# Altium schematic sheet MCU.SchDoc
size A4
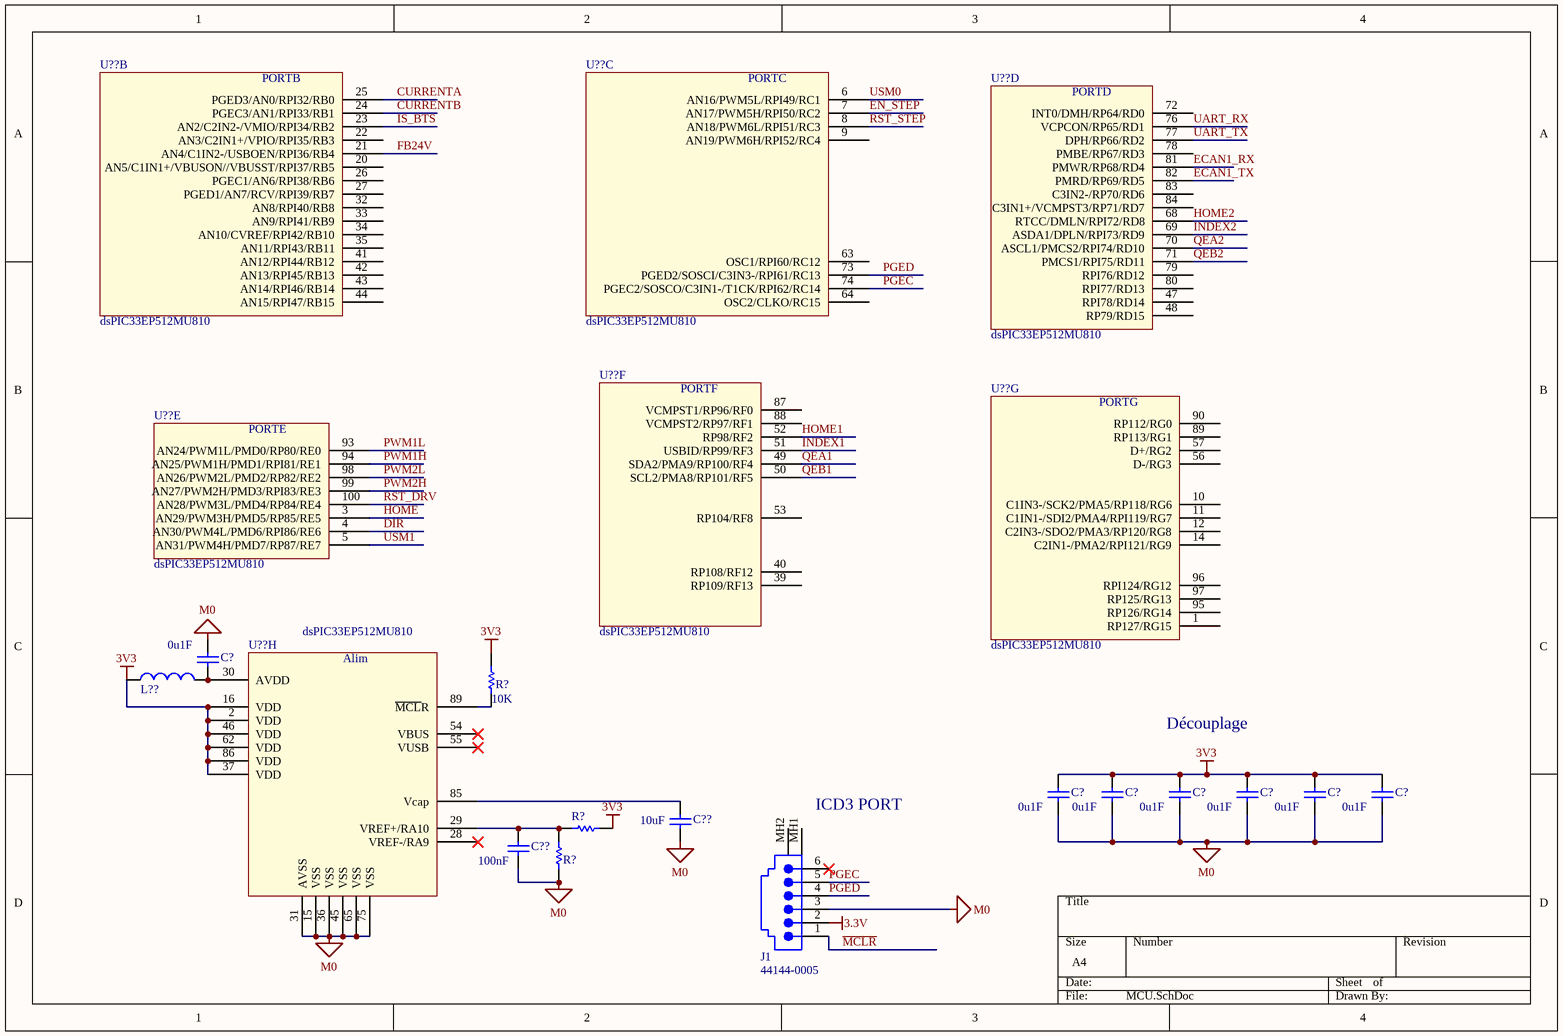
[diagram p0: MCU.SchDoc]

## Parts
(Parts that share a designator on the sheet are numbered #1, #2 ... from top to bottom, then left to right.)
C?#1  value 0u1F  [0603]  (hidden comment: C0603)
C?#2  value 0u1F  [0603]  (hidden comment: C0603)
C?#3  value 0u1F  [0603]  (hidden comment: C0603)
C?#4  value 0u1F  [0603]  (hidden comment: C0603)
C?#5  value 0u1F  [0603]  (hidden comment: C0603)
C?#6  value 0u1F  [0603]  (hidden comment: C0603)
C?#7  value 0u1F  [0603]  (hidden comment: C0603)
C??#1  10uF  [C0805]
C??#2  100nF  [C0805]
J1  44144-0005  [44144-0005]
L??  Ferrite_0805  [R0805]  (value not drawn)
R?#1  10K  [R0805]
R?#2  (no value)  [R0805]
R?#3  (no value)  [R0805]
U??#1  dsPIC33EP512MU810  (part C of 8)
U??#2  dsPIC33EP512MU810  (part B of 8)
U??#3  dsPIC33EP512MU810  (part D of 8)
U??#4  dsPIC33EP512MU810  (part E of 8)
U??#5  dsPIC33EP512MU810  (part G of 8)
U??#6  dsPIC33EP512MU810  (part F of 8)
U??#7  dsPIC33EP512MU810  (part H of 8)

## Nets
3.3V: J1.2
3V3: C?#2.2 C?#3.2 C?#4.2 C?#5.2 C?#6.2 C?#7.2 R?#1.2 R?#2.1 U??#7.2(VDD) U??#7.16(VDD) U??#7.37(VDD) U??#7.46(VDD) U??#7.62(VDD) U??#7.86(VDD)
M0: C?#1.2 C?#2.1 C?#3.1 C?#4.1 C?#5.1 C?#6.1 C?#7.1 C??#1.2 C??#2.2 J1.3 R?#3.1 U??#7.15(VSS) U??#7.31(AVSS) U??#7.36(VSS) U??#7.45(VSS) U??#7.65(VSS) U??#7.75(VSS)
CURRENTA: U??#2.25(PGED3/AN0/RPI32/RB0)
CURRENTB: U??#2.24(PGEC3/AN1/RPI33/RB1)
DIR: U??#4.4(AN30/PWM4L/PMD6/RPI86/RE6)
ECAN1_RX: U??#3.81(PMWR/RP68/RD4)
ECAN1_TX: U??#3.82(PMRD/RP69/RD5)
EN_STEP: U??#1.7(AN17/PWM5H/RPI50/RC2)
FB24V: U??#2.21(AN4/C1IN2-/USBOEN/RPI36/RB4)
HOME: U??#4.3(AN29/PWM3H/PMD5/RP85/RE5)
HOME1: U??#6.52(RP98/RF2)
HOME2: U??#3.68(RTCC/DMLN/RPI72/RD8)
INDEX1: U??#6.51(USBID/RP99/RF3)
INDEX2: U??#3.69(ASDA1/DPLN/RPI73/RD9)
IS_BTS: U??#2.23(AN2/C2IN2-/VMIO/RPI34/RB2)
~{MCLR}: J1.1
PGEC: J1.5 U??#1.74(PGEC2/SOSCO/C3IN1-/T1CK/RPI62/RC14)
PGED: J1.4 U??#1.73(PGED2/SOSCI/C3IN3-/RPI61/RC13)
PWM1H: U??#4.94(AN25/PWM1H/PMD1/RPI81/RE1)
PWM1L: U??#4.93(AN24/PWM1L/PMD0/RP80/RE0)
PWM2H: U??#4.99(AN27/PWM2H/PMD3/RPI83/RE3)
PWM2L: U??#4.98(AN26/PWM2L/PMD2/RP82/RE2)
QEA1: U??#6.49(SDA2/PMA9/RP100/RF4)
QEA2: U??#3.70(ASCL1/PMCS2/RPI74/RD10)
QEB1: U??#6.50(SCL2/PMA8/RP101/RF5)
QEB2: U??#3.71(PMCS1/RPI75/RD11)
RST_DRV: U??#4.100(AN28/PWM3L/PMD4/RP84/RE4)
RST_STEP: U??#1.8(AN18/PWM6L/RPI51/RC3)
UART_RX: U??#3.76(VCPCON/RP65/RD1)
UART_TX: U??#3.77(DPH/RP66/RD2)
USM0: U??#1.6(AN16/PWM5L/RPI49/RC1)
USM1: U??#4.5(AN31/PWM4H/PMD7/RP87/RE7)
NetC?#1_1: C?#1.1 L??.2 U??#7.30(AVDD)
NetC??#1_1: C??#1.1 U??#7.85(Vcap)
NetC??#2_1: C??#2.1 R?#2.2 R?#3.2 U??#7.29(VREF+/RA10)
NetR?#1_1: R?#1.1 U??#7.89(~{MCL}R)

Not connected (* = marked no-connect by the designer): J1 6* MH1(Shield) MH2(Shield); L?? 1; U??#1 9(AN19/PWM6H/RPI52/RC4) 63(OSC1/RPI60/RC12) 64(OSC2/CLKO/RC15); U??#2 20(AN5/C1IN1+/VBUSON//VBUSST/RPI37/RB5) 22(AN3/C2IN1+/VPIO/RPI35/RB3) 26(PGEC1/AN6/RPI38/RB6) 27(PGED1/AN7/RCV/RPI39/RB7) 32(AN8/RPI40/RB8) 33(AN9/RPI41/RB9) 34(AN10/CVREF/RPI42/RB10) 35(AN11/RPI43/RB11) 41(AN12/RPI44/RB12) 42(AN13/RPI45/RB13) 43(AN14/RPI46/RB14) 44(AN15/RPI47/RB15); U??#3 47(RPI78/RD14) 48(RP79/RD15) 72(INT0/DMH/RP64/RD0) 78(PMBE/RP67/RD3) 79(RPI76/RD12) 80(RPI77/RD13) 83(C3IN2-/RP70/RD6) 84(C3IN1+/VCMPST3/RP71/RD7); U??#5 1(RP127/RG15) 10(C1IN3-/SCK2/PMA5/RP118/RG6) 11(C1IN1-/SDI2/PMA4/RPI119/RG7) 12(C2IN3-/SDO2/PMA3/RP120/RG8) 14(C2IN1-/PMA2/RPI121/RG9) 56(D-/RG3) 57(D+/RG2) 89(RP113/RG1) 90(RP112/RG0) 95(RP126/RG14) 96(RPI124/RG12) 97(RP125/RG13); U??#6 39(RP109/RF13) 40(RP108/RF12) 53(RP104/RF8) 87(VCMPST1/RP96/RF0) 88(VCMPST2/RP97/RF1); U??#7 28(VREF-/RA9)* 54(VBUS)* 55(VUSB)*

## Notes on the sheet
- Découplage
- (near J1) ICD3 PORT
- (in symbol dsPIC33EP512MU810-I/PF, part B) PORTB
- (in symbol dsPIC33EP512MU810-I/PF, part C) PORTC
- (in symbol dsPIC33EP512MU810-I/PF, part D) PORTD
- (in symbol dsPIC33EP512MU810-I/PF, part E) PORTE
- (in symbol dsPIC33EP512MU810-I/PF, part F) PORTF
- (in symbol dsPIC33EP512MU810-I/PF, part G) PORTG
- (in symbol dsPIC33EP512MU810-I/PF, part H) Alim

## Library data of the parts
C?#1-C?#7 = C0603: Ceramic Chip Capacitor - Standard; Note: Footprint corresponds to dimensions for bulk cassette packaging. This case size has tightened tolerances.; Published: 17-Jul-2002; LatestRevisionDate: 19-Mar-2004; LatestRevisionNote: Silkscreen size reduced.; DatasheetDocument: Mar-2001; PackageDocument: Mar-2001; PackageReference: 0603; Publisher: Altium Limited; Code_JEITA: 0603; Code_IPC: 1608 [0603]; ComponentLink1Description: Manufacturer Link; ComponentLink1URL: http://www.kemet.com/; ComponentLink2Description: Datasheet; ComponentLink2URL: http://www.kemet.com/kemet/web/homepage/kechome.nsf/vapubfilesname/F3102TA.pdf/$file/F3102TA.pdf
C??#1 C??#2 = C0805: Ceramic Chip Capacitor - Standard; Note: Footprint corresponds to dimensions for bulk cassette packaging. This case size has tightened tolerances.; Value: 100pF; Published: 17-Jul-2002; LatestRevisionDate: 19-Mar-2004; LatestRevisionNote: Silkscreen size reduced.; DatasheetDocument: Mar-2001; PackageDocument: Mar-2001; PackageReference: 0805; Publisher: Altium Limited; Code_JEITA: 0805; Code_IPC: 2012[0805]; ComponentLink1Description: Manufacturer Link; ComponentLink1URL: http://www.kemet.com/; ComponentLink2Description: Datasheet; ComponentLink2URL: http://www.kemet.com/kemet/web/homepage/kechome.nsf/vapubfilesname/F3102TA.pdf/$file/F3102TA.pdf
J1 = 44144-0005: SMT, Right Angle, Low Profile, with Flush Fitting Nails PCB Jack; Ports: 1; Positions/Loaded: Port1 - 6/6; PerformanceCategory: 3; DrillSize: Nominal, Rounded to nearest 0.05mm; PCB_Layout: Complies with Manufacturer's Recommendation.; Published: 25-Jun-2002; DatasheetDocument: 19-Dec-2001; PackageDocument: 19-Dec-2001; PackageReference: 44144-0005; Publisher: Altium Limited; PCB_Mounting: SMT; ComponentLink1Description: Manufacturer Link; ComponentLink1URL: http://www.molex.com/; ComponentLink2Description: Datasheet; ComponentLink2URL: http://www.molex.com/cmc_upload/common_files/1222003_mx44144.pdf
L?? = Ferrite_0805: Ferrite
R?#1-R?#3 = R0805: Resistor 0805
U??#1-U??#7 = dsPIC33EP512MU810-I/PF: High-Performance, 16-bit  Digital Signal Controllers  and Microcontrollers; Supplier 1: Digi-Key; Supplier Part Number 1: DSPIC33EP512MU810-I/PF-ND